# EAGLE schematic aircat (EAGLE 6.1)
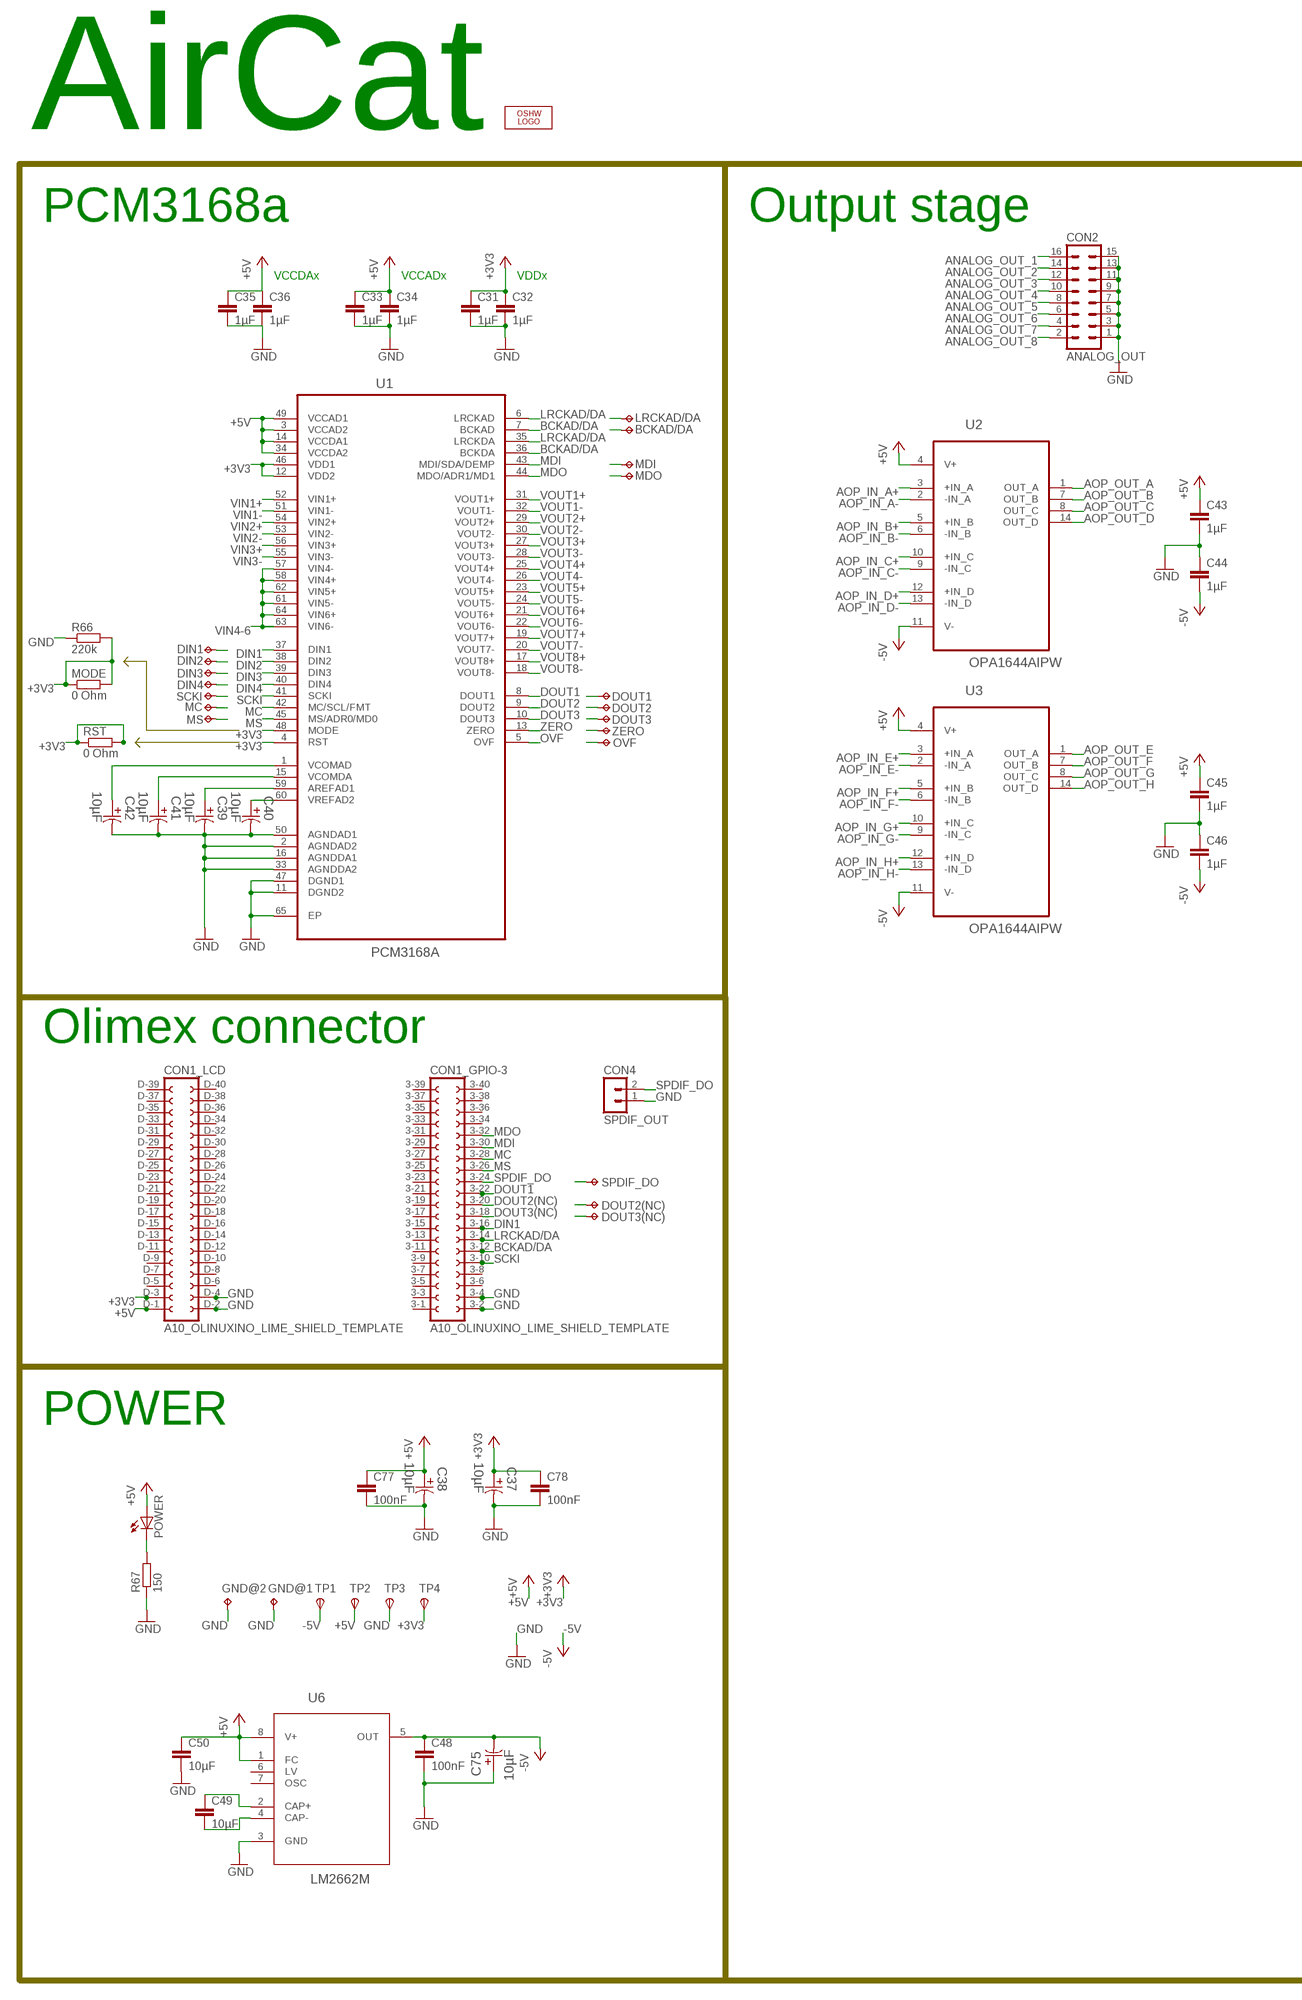
[diagram p0: schematic, sheet 1, part 1 of 2]
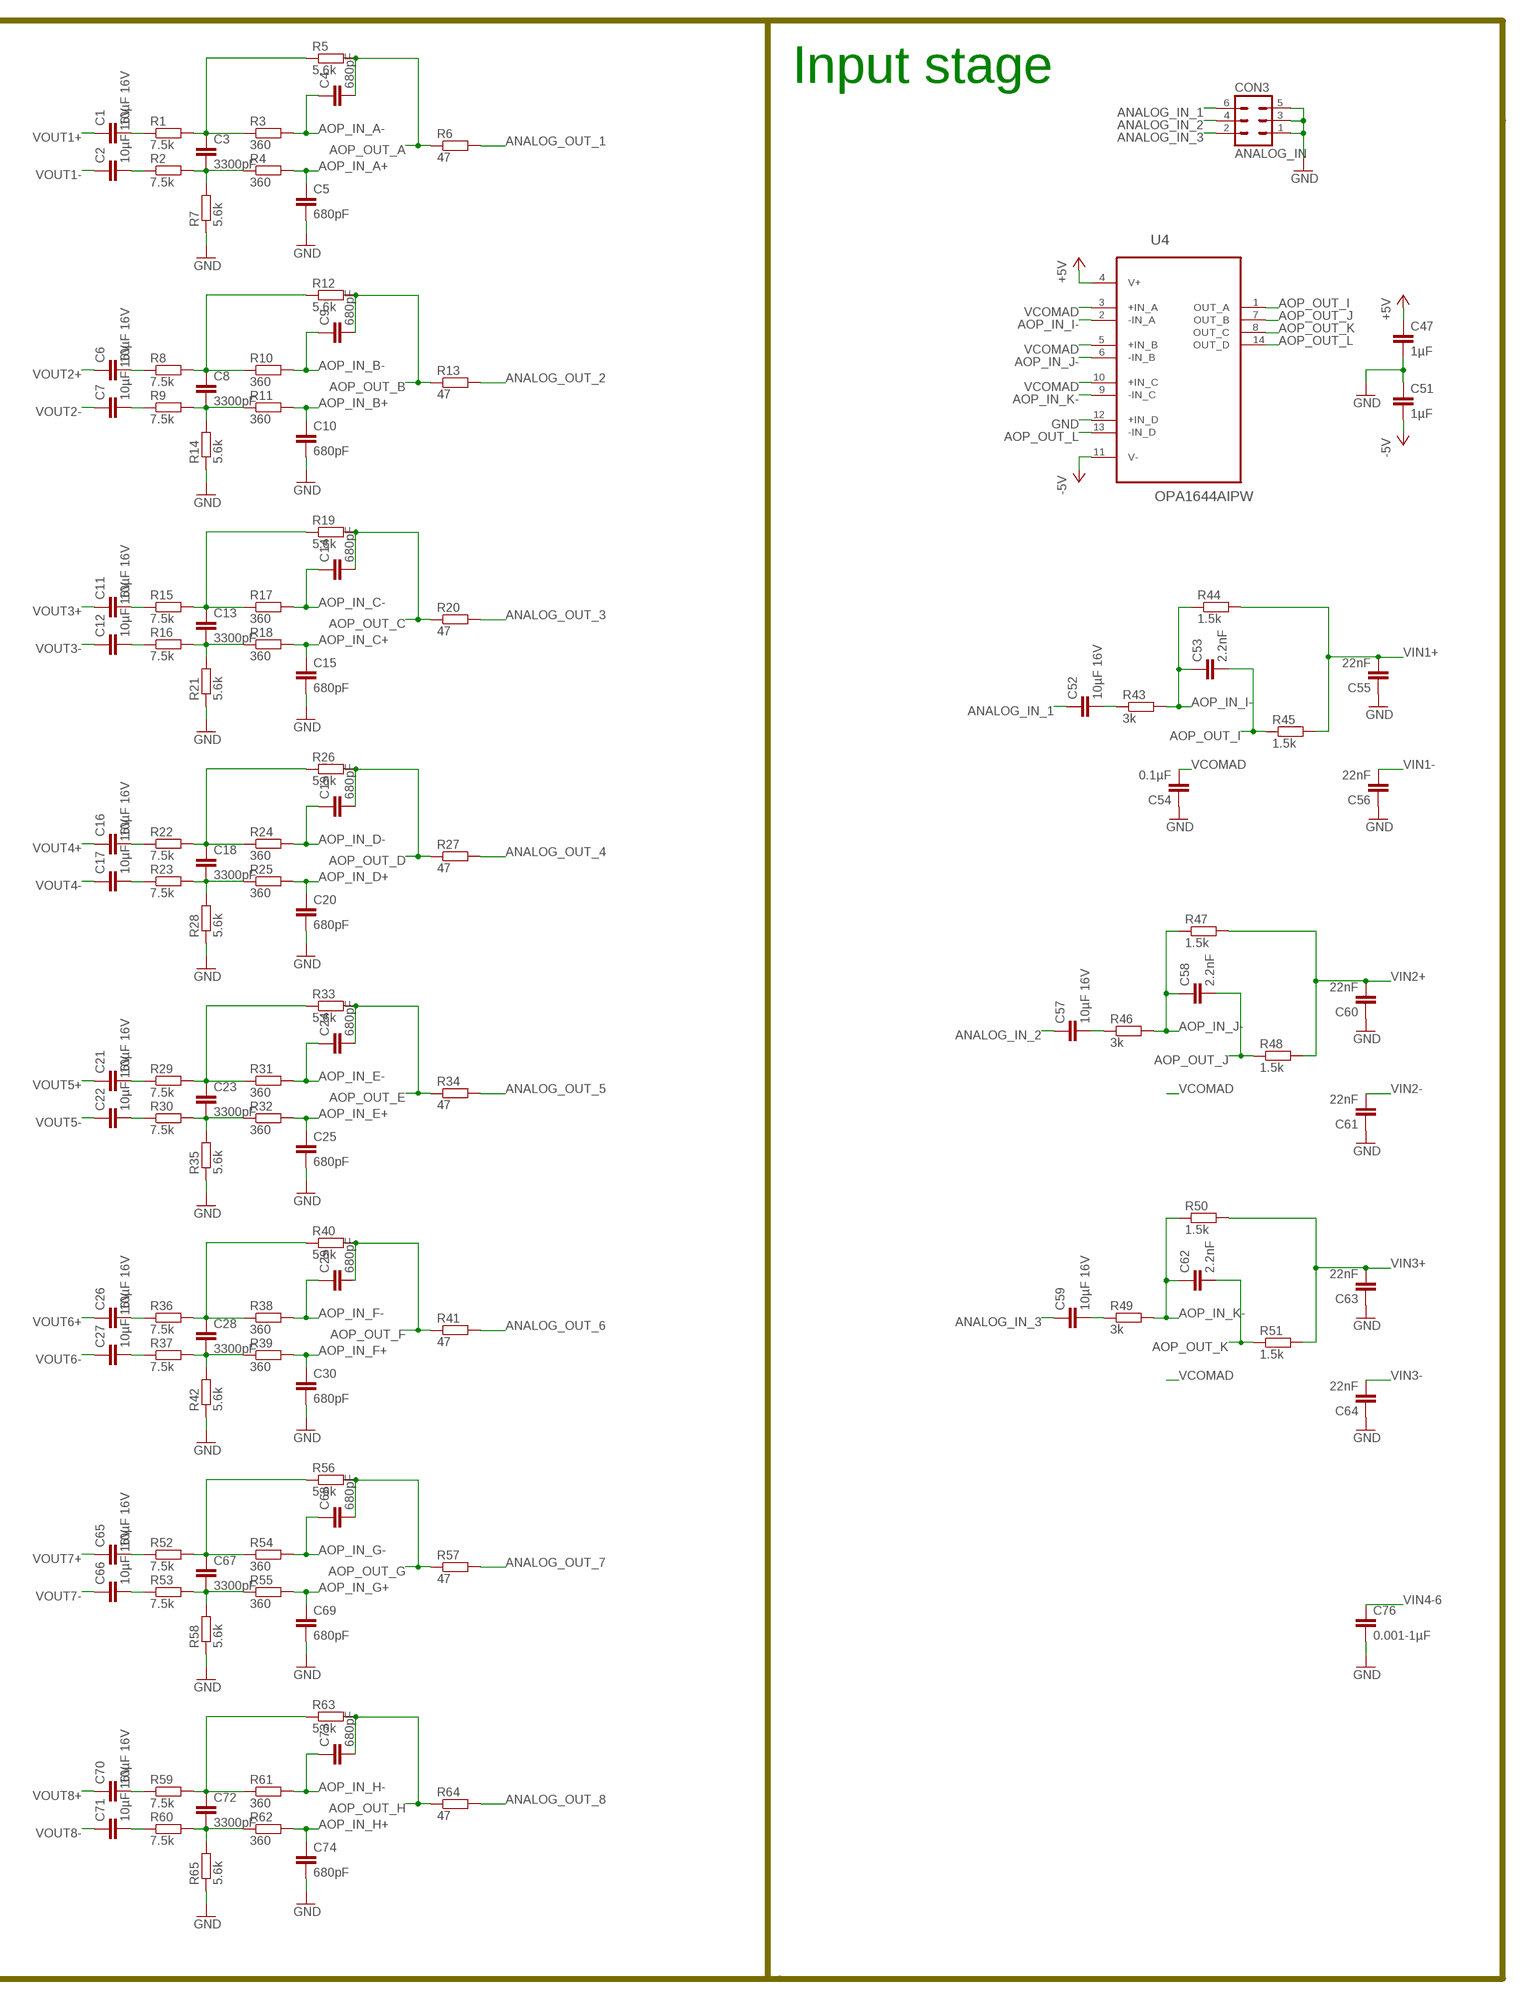
[diagram p1: schematic, sheet 1, part 2 of 2]

## Parts
BCKAD/DA  TPTP10SQ  [TP10SQ]
C1  10µF 16V  C-EUC0805  [C0805]
C2  10µF 16V  C-EUC0805  [C0805]
C3  3300pF  C-EUC0603  [C0603]
C4  680pF  C-EUC0603  [C0603]
C5  680pF  C-EUC0603  [C0603]
C6  10µF 16V  C-EUC0805  [C0805]
C7  10µF 16V  C-EUC0805  [C0805]
C8  3300pF  C-EUC0603  [C0603]
C9  680pF  C-EUC0603  [C0603]
C10  680pF  C-EUC0603  [C0603]
C11  10µF 16V  C-EUC0805  [C0805]
C12  10µF 16V  C-EUC0805  [C0805]
C13  3300pF  C-EUC0603  [C0603]
C14  680pF  C-EUC0603  [C0603]
C15  680pF  C-EUC0603  [C0603]
C16  10µF 16V  C-EUC0805  [C0805]
C17  10µF 16V  C-EUC0805  [C0805]
C18  3300pF  C-EUC0603  [C0603]
C19  680pF  C-EUC0603  [C0603]
C20  680pF  C-EUC0603  [C0603]
C21  10µF 16V  C-EUC0805  [C0805]
C22  10µF 16V  C-EUC0805  [C0805]
C23  3300pF  C-EUC0603  [C0603]
C24  680pF  C-EUC0603  [C0603]
C25  680pF  C-EUC0603  [C0603]
C26  10µF 16V  C-EUC0805  [C0805]
C27  10µF 16V  C-EUC0805  [C0805]
C28  3300pF  C-EUC0603  [C0603]
C29  680pF  C-EUC0603  [C0603]
C30  680pF  C-EUC0603  [C0603]
C31  1µF  C-EUC0603  [C0603]
C32  1µF  C-EUC0603  [C0603]
C33  1µF  C-EUC0603  [C0603]
C34  1µF  C-EUC0603  [C0603]
C35  1µF  C-EUC0603  [C0603]
C36  1µF  C-EUC0603  [C0603]
C37  10µF  EEE-FK1V100UR-CASE-B  [CAPAE430X610N]
C38  10µF  EEE-FK1V100UR-CASE-B  [CAPAE430X610N]
C39  10µF  EEE-FK1V100UR-CASE-B  [CAPAE430X610N]
C40  10µF  EEE-FK1V100UR-CASE-B  [CAPAE430X610N]
C41  10µF  EEE-FK1V100UR-CASE-B  [CAPAE430X610N]
C42  10µF  EEE-FK1V100UR-CASE-B  [CAPAE430X610N]
C43  1µF  C-EUC0603  [C0603]
C44  1µF  C-EUC0603  [C0603]
C45  1µF  C-EUC0603  [C0603]
C46  1µF  C-EUC0603  [C0603]
C47  1µF  C-EUC0603  [C0603]
C48  100nF  C-EUC0603  [C0603]
C49  10µF  C-EUC0805  [C0805]
C50  10µF  C-EUC0805  [C0805]
C51  1µF  C-EUC0603  [C0603]
C52  10µF 16V  C-EUC0805  [C0805]
C53  2.2nF  C-EUC0603  [C0603]
C54  0.1µF  C-EUC0603  [C0603]
C55  22nF  C-EUC0603  [C0603]
C56  22nF  C-EUC0603  [C0603]
C57  10µF 16V  C-EUC0805  [C0805]
C58  2.2nF  C-EUC0603  [C0603]
C59  10µF 16V  C-EUC0805  [C0805]
C60  22nF  C-EUC0603  [C0603]
C61  22nF  C-EUC0603  [C0603]
C62  2.2nF  C-EUC0603  [C0603]
C63  22nF  C-EUC0603  [C0603]
C64  22nF  C-EUC0603  [C0603]
C65  10µF 16V  C-EUC0805  [C0805]
C66  10µF 16V  C-EUC0805  [C0805]
C67  3300pF  C-EUC0603  [C0603]
C68  680pF  C-EUC0603  [C0603]
C69  680pF  C-EUC0603  [C0603]
C70  10µF 16V  C-EUC0805  [C0805]
C71  10µF 16V  C-EUC0805  [C0805]
C72  3300pF  C-EUC0603  [C0603]
C73  680pF  C-EUC0603  [C0603]
C74  680pF  C-EUC0603  [C0603]
C75  10µF  EEE-FK1V100UR-CASE-B  [CAPAE430X610N]
C76  0.001-1µF  C-EUC0603  [C0603]
C77  100nF  C-EUC0603  [C0603]
C78  100nF  C-EUC0603  [C0603]
CON1  A10_OLINUXINO_LIME_SHIELD_TEMPLATE  [A10_OLINUXINO_LIME_SHIELD]
CON2  ANALOG_OUT  MA08-2  [MA08-2]
CON3  ANALOG_IN  MA03-2  [MA03-2]
CON4  SPDIF_OUT  MA02-1  [MA02-1]
DIN1  TPTP10SQ  [TP10SQ]
DIN2  TPTP10SQ  [TP10SQ]
DIN3  TPTP10SQ  [TP10SQ]
DIN4  TPTP10SQ  [TP10SQ]
DOUT1  TPTP10SQ  [TP10SQ]
DOUT2  TPTP10SQ  [TP10SQ]
DOUT2(NC)  TPTP10SQ  [TP10SQ]
DOUT3  TPTP10SQ  [TP10SQ]
DOUT3(NC)  TPTP10SQ  [TP10SQ]
GND@1  TPTP10SQ  [TP10SQ]
GND@2  TPTP10SQ  [TP10SQ]
LOGO1  OSHW_LOGO_FILLX0200-NT  [OSHW_FILLX200_NOTEXT]
LRCKAD/DA  TPTP10SQ  [TP10SQ]
MC  TPTP10SQ  [TP10SQ]
MDI  TPTP10SQ  [TP10SQ]
MDO  TPTP10SQ  [TP10SQ]
MODE  0 Ohm  R-EU_R0603  [R0603]
MS  TPTP10SQ  [TP10SQ]
OVF  TPTP10SQ  [TP10SQ]
POWER  LEDSML0603  [SML0603]
R1  7.5k  R-EU_R0603  [R0603]
R2  7.5k  R-EU_R0603  [R0603]
R3  360  R-EU_R0603  [R0603]
R4  360  R-EU_R0603  [R0603]
R5  5.6k  R-EU_R0603  [R0603]
R6  47  R-EU_R0603  [R0603]
R7  5.6k  R-EU_R0603  [R0603]
R8  7.5k  R-EU_R0603  [R0603]
R9  7.5k  R-EU_R0603  [R0603]
R10  360  R-EU_R0603  [R0603]
R11  360  R-EU_R0603  [R0603]
R12  5.6k  R-EU_R0603  [R0603]
R13  47  R-EU_R0603  [R0603]
R14  5.6k  R-EU_R0603  [R0603]
R15  7.5k  R-EU_R0603  [R0603]
R16  7.5k  R-EU_R0603  [R0603]
R17  360  R-EU_R0603  [R0603]
R18  360  R-EU_R0603  [R0603]
R19  5.6k  R-EU_R0603  [R0603]
R20  47  R-EU_R0603  [R0603]
R21  5.6k  R-EU_R0603  [R0603]
R22  7.5k  R-EU_R0603  [R0603]
R23  7.5k  R-EU_R0603  [R0603]
R24  360  R-EU_R0603  [R0603]
R25  360  R-EU_R0603  [R0603]
R26  5.6k  R-EU_R0603  [R0603]
R27  47  R-EU_R0603  [R0603]
R28  5.6k  R-EU_R0603  [R0603]
R29  7.5k  R-EU_R0603  [R0603]
R30  7.5k  R-EU_R0603  [R0603]
R31  360  R-EU_R0603  [R0603]
R32  360  R-EU_R0603  [R0603]
R33  5.6k  R-EU_R0603  [R0603]
R34  47  R-EU_R0603  [R0603]
R35  5.6k  R-EU_R0603  [R0603]
R36  7.5k  R-EU_R0603  [R0603]
R37  7.5k  R-EU_R0603  [R0603]
R38  360  R-EU_R0603  [R0603]
R39  360  R-EU_R0603  [R0603]
R40  5.6k  R-EU_R0603  [R0603]
R41  47  R-EU_R0603  [R0603]
R42  5.6k  R-EU_R0603  [R0603]
R43  3k  R-EU_R0603  [R0603]
R44  1.5k  R-EU_R0603  [R0603]
R45  1.5k  R-EU_R0603  [R0603]
R46  3k  R-EU_R0603  [R0603]
R47  1.5k  R-EU_R0603  [R0603]
R48  1.5k  R-EU_R0603  [R0603]
R49  3k  R-EU_R0603  [R0603]
R50  1.5k  R-EU_R0603  [R0603]
R51  1.5k  R-EU_R0603  [R0603]
R52  7.5k  R-EU_R0603  [R0603]
R53  7.5k  R-EU_R0603  [R0603]
R54  360  R-EU_R0603  [R0603]
R55  360  R-EU_R0603  [R0603]
R56  5.6k  R-EU_R0603  [R0603]
R57  47  R-EU_R0603  [R0603]
R58  5.6k  R-EU_R0603  [R0603]
R59  7.5k  R-EU_R0603  [R0603]
R60  7.5k  R-EU_R0603  [R0603]
R61  360  R-EU_R0603  [R0603]
R62  360  R-EU_R0603  [R0603]
R63  5.6k  R-EU_R0603  [R0603]
R64  47  R-EU_R0603  [R0603]
R65  5.6k  R-EU_R0603  [R0603]
R66  220k  R-EU_R0603  [R0603]
R67  150  R-EU_R0603  [R0603]
RST  0 Ohm  R-EU_R0603  [R0603]
SCKI  TPTP10SQ  [TP10SQ]
SPDIF_DO  TPTP10SQ  [TP10SQ]
TP1  -5V  TPSB1,27  [B1,27]
TP2  +5V  TPSB1,27  [B1,27]
TP3  GND  TPSB1,27  [B1,27]
TP4  +3V3  TPSB1,27  [B1,27]
U1  PCM3168A  PCM3168APAP  [QFP50P1200X1200X120-65N]
U2  OPA1644AIPW  [SOP65P640X120-14N]
U3  OPA1644AIPW  [SOP65P640X120-14N]
U4  OPA1644AIPW  [SOP65P640X120-14N]
U6  LM2662M  [SOIC127P620X175-8N]
ZERO  TPTP10SQ  [TP10SQ]

## Nets
+3V3: C31.1 C32.1 C37.1 C78.1 CON1.D-3 MODE.1 MODE.2 R66.2 RST.1 RST.2 TP4.TP(PP) U1.4(RST) U1.12(VDD2) U1.46(VDD1) U1.48(MODE)
+5V: C33.1 C34.1 C35.1 C36.1 C38.1 C43.1 C45.1 C47.1 C50.1 C77.1 CON1.D-1 POWER.A TP2.TP(PP) U1.3(VCCAD2) U1.14(VCCDA1) U1.34(VCCDA2) U1.49(VCCAD1) U2.4(V+) U3.4(V+) U4.4(V+) U6.1(FC) U6.8(V+)
-5V: C44.2 C46.2 C48.1 C51.2 C75.2 TP1.TP(PP) U2.11(V-) U3.11(V-) U4.11(V-) U6.5(OUT)
ANALOG_IN_1: C52.1 CON3.6
ANALOG_IN_2: C57.1 CON3.4
ANALOG_IN_3: C59.1 CON3.2
ANALOG_OUT_1: CON2.16 R6.2
ANALOG_OUT_2: CON2.14 R13.2
ANALOG_OUT_3: CON2.12 R20.2
ANALOG_OUT_4: CON2.10 R27.2
ANALOG_OUT_5: CON2.8 R34.2
ANALOG_OUT_6: CON2.6 R41.2
ANALOG_OUT_7: CON2.4 R57.2
ANALOG_OUT_8: CON2.2 R64.2
AOP_IN_A+: C5.1 R4.2 U2.3(+IN_A)
AOP_IN_A-: C4.1 R3.2 U2.2(-IN_A)
AOP_IN_B+: C10.1 R11.2 U2.5(+IN_B)
AOP_IN_B-: C9.1 R10.2 U2.6(-IN_B)
AOP_IN_C+: C15.1 R18.2 U2.10(+IN_C)
AOP_IN_C-: C14.1 R17.2 U2.9(-IN_C)
AOP_IN_D+: C20.1 R25.2 U2.12(+IN_D)
AOP_IN_D-: C19.1 R24.2 U2.13(-IN_D)
AOP_IN_E+: C25.1 R32.2 U3.3(+IN_A)
AOP_IN_E-: C24.1 R31.2 U3.2(-IN_A)
AOP_IN_F+: C30.1 R39.2 U3.5(+IN_B)
AOP_IN_F-: C29.1 R38.2 U3.6(-IN_B)
AOP_IN_G+: C69.1 R55.2 U3.10(+IN_C)
AOP_IN_G-: C68.1 R54.2 U3.9(-IN_C)
AOP_IN_H+: C74.1 R62.2 U3.12(+IN_D)
AOP_IN_H-: C73.1 R61.2 U3.13(-IN_D)
AOP_IN_I-: C53.1 R43.2 R44.1 U4.2(-IN_A)
AOP_IN_J-: C58.1 R46.2 R47.1 U4.6(-IN_B)
AOP_IN_K-: C62.1 R49.2 R50.1 U4.9(-IN_C)
AOP_OUT_A: C4.2 R5.2 R6.1 U2.1(OUT_A)
AOP_OUT_B: C9.2 R12.2 R13.1 U2.7(OUT_B)
AOP_OUT_C: C14.2 R19.2 R20.1 U2.8(OUT_C)
AOP_OUT_D: C19.2 R26.2 R27.1 U2.14(OUT_D)
AOP_OUT_E: C24.2 R33.2 R34.1 U3.1(OUT_A)
AOP_OUT_F: C29.2 R40.2 R41.1 U3.7(OUT_B)
AOP_OUT_G: C68.2 R56.2 R57.1 U3.8(OUT_C)
AOP_OUT_H: C73.2 R63.2 R64.1 U3.14(OUT_D)
AOP_OUT_I: C53.2 R45.1 U4.1(OUT_A)
AOP_OUT_J: C58.2 R48.1 U4.7(OUT_B)
AOP_OUT_K: C62.2 R51.1 U4.8(OUT_C)
AOP_OUT_L: U4.13(-IN_D) U4.14(OUT_D)
AREFAD1: C39.1 U1.59(AREFAD1)
BCKAD/DA: BCKAD/DA.TP CON1.3-12 U1.7(BCKAD) U1.36(BCKDA)
DIN1: CON1.3-16 DIN1.TP U1.37(DIN1)
DIN2: DIN2.TP U1.38(DIN2)
DIN3: DIN3.TP U1.39(DIN3)
DIN4: DIN4.TP U1.40(DIN4)
DOUT1: CON1.3-22 DOUT1.TP U1.8(DOUT1)
DOUT2: DOUT2.TP U1.9(DOUT2)
DOUT2(NC): CON1.3-20 DOUT2(NC).TP
DOUT3: DOUT3.TP U1.10(DOUT3)
DOUT3(NC): CON1.3-18 DOUT3(NC).TP
GND: C5.2 C10.2 C15.2 C20.2 C25.2 C30.2 C31.2 C32.2 C33.2 C34.2 C35.2 C36.2 C37.2 C38.2 C39.2 C40.2 C41.2 C42.2 C43.2 C44.1 C45.2 C46.1 C47.2 C48.2 C50.2 C51.1 C54.1 C55.1 C56.1 C60.1 C61.1 C63.1 C64.1 C69.2 C74.2 C75.1 C76.2 C77.2 C78.2 CON1.3-2 CON1.3-4 CON1.D-2 CON1.D-4 CON2.1 CON2.3 CON2.5 CON2.7 CON2.9 CON2.11 CON2.13 CON2.15 CON3.1 CON3.3 CON3.5 CON4.1 GND@1.TP GND@2.TP R7.1 R14.1 R21.1 R28.1 R35.1 R42.1 R58.1 R65.1 R66.1 R67.1 TP3.TP(PP) U1.2(AGNDAD2) U1.11(DGND2) U1.16(AGNDDA1) U1.33(AGNDDA2) U1.47(DGND1) U1.50(AGNDAD1) U1.65(EP) U4.12(+IN_D) U6.3(GND)
LRCKAD/DA: CON1.3-14 LRCKAD/DA.TP U1.6(LRCKAD) U1.35(LRCKDA)
MC: CON1.3-28 MC.TP U1.42(MC/SCL/FMT)
MDI: CON1.3-30 MDI.TP U1.43(MDI/SDA/DEMP)
MDO: CON1.3-32 MDO.TP U1.44(MDO/ADR1/MD1)
MS: CON1.3-26 MS.TP U1.45(MS/ADR0/MD0)
N$1: C2.2 R2.1
N$2: C1.2 R1.1
N$3: C3.1 R1.2 R3.1 R5.1
N$4: C3.2 R2.2 R4.1 R7.2
N$5: C7.2 R9.1
N$6: C6.2 R8.1
N$7: C8.1 R8.2 R10.1 R12.1
N$8: C8.2 R9.2 R11.1 R14.2
N$9: C12.2 R16.1
N$10: C11.2 R15.1
N$11: C13.1 R15.2 R17.1 R19.1
N$12: C13.2 R16.2 R18.1 R21.2
N$13: C17.2 R23.1
N$14: C16.2 R22.1
N$15: C18.1 R22.2 R24.1 R26.1
N$16: C18.2 R23.2 R25.1 R28.2
N$17: C22.2 R30.1
N$18: C21.2 R29.1
N$19: C23.1 R29.2 R31.1 R33.1
N$20: C23.2 R30.2 R32.1 R35.2
N$21: C27.2 R37.1
N$22: C26.2 R36.1
N$23: C28.1 R36.2 R38.1 R40.1
N$24: C28.2 R37.2 R39.1 R42.2
N$25: C52.2 R43.1
N$26: C57.2 R46.1
N$27: C59.2 R49.1
N$28: C66.2 R53.1
N$29: C65.2 R52.1
N$30: C67.1 R52.2 R54.1 R56.1
N$31: C67.2 R53.2 R55.1 R58.2
N$32: C71.2 R60.1
N$33: C70.2 R59.1
N$34: C49.1 U6.2(CAP+)
N$35: C49.2 U6.4(CAP-)
N$36: C72.1 R59.2 R61.1 R63.1
N$37: C72.2 R60.2 R62.1 R65.2
N$38: POWER.C R67.2
OVF: OVF.TP U1.5(OVF)
SCKI: CON1.3-10 SCKI.TP U1.41(SCKI)
SPDIF_DO: CON1.3-24 CON4.2 SPDIF_DO.TP
VCOMAD: C42.1 C54.2 U1.1(VCOMAD) U4.3(+IN_A) U4.5(+IN_B) U4.10(+IN_C)
VCOMDA: C41.1 U1.15(VCOMDA)
VIN1+: C55.2 R44.2 R45.2 U1.52(VIN1+)
VIN1-: C56.2 U1.51(VIN1-)
VIN2+: C60.2 R47.2 R48.2 U1.54(VIN2+)
VIN2-: C61.2 U1.53(VIN2-)
VIN3+: C63.2 R50.2 R51.2 U1.56(VIN3+)
VIN3-: C64.2 U1.55(VIN3-)
VIN4-6: C76.1 U1.57(VIN4-) U1.58(VIN4+) U1.61(VIN5-) U1.62(VIN5+) U1.63(VIN6-) U1.64(VIN6+)
VOUT1+: C1.1 U1.31(VOUT1+)
VOUT1-: C2.1 U1.32(VOUT1-)
VOUT2+: C6.1 U1.29(VOUT2+)
VOUT2-: C7.1 U1.30(VOUT2-)
VOUT3+: C11.1 U1.27(VOUT3+)
VOUT3-: C12.1 U1.28(VOUT3-)
VOUT4+: C16.1 U1.25(VOUT4+)
VOUT4-: C17.1 U1.26(VOUT4-)
VOUT5+: C21.1 U1.23(VOUT5+)
VOUT5-: C22.1 U1.24(VOUT5-)
VOUT6+: C26.1 U1.21(VOUT6+)
VOUT6-: C27.1 U1.22(VOUT6-)
VOUT7+: C65.1 U1.19(VOUT7+)
VOUT7-: C66.1 U1.20(VOUT7-)
VOUT8+: C70.1 U1.17(VOUT8+)
VOUT8-: C71.1 U1.18(VOUT8-)
VREFAD2: C40.1 U1.60(VREFAD2)
ZERO: U1.13(ZERO) ZERO.TP
Unconnected: CON1.3-1 CON1.3-3 CON1.3-5 CON1.3-6 CON1.3-7 CON1.3-8 CON1.3-9 CON1.3-11 CON1.3-13 CON1.3-15 CON1.3-17 CON1.3-19 CON1.3-21 CON1.3-23 CON1.3-25 CON1.3-27 CON1.3-29 CON1.3-31 CON1.3-33 CON1.3-34 CON1.3-35 CON1.3-36 CON1.3-37 CON1.3-38 CON1.3-39 CON1.3-40 CON1.D-5 CON1.D-6 CON1.D-7 CON1.D-8 CON1.D-9 CON1.D-10 CON1.D-11 CON1.D-12 CON1.D-13 CON1.D-14 CON1.D-15 CON1.D-16 CON1.D-17 CON1.D-18 CON1.D-19 CON1.D-20 CON1.D-21 CON1.D-22 CON1.D-23 CON1.D-24 CON1.D-25 CON1.D-26 CON1.D-27 CON1.D-28 CON1.D-29 CON1.D-30 CON1.D-31 CON1.D-32 CON1.D-33 CON1.D-34 CON1.D-35 CON1.D-36 CON1.D-37 CON1.D-38 CON1.D-39 CON1.D-40 U6.6(LV) U6.7(OSC)

## Notes on the sheet
- AirCat
- PCM3168a | Output stage | Input stage
- VCCDAx | VCCADx | VDDx
- Olimex connector
- POWER

## Library data of the parts
BCKAD/DA DIN1-DIN4 DOUT1 DOUT2 DOUT2(NC) DOUT3 DOUT3(NC) GND@1 GND@2 LRCKAD/DA MC MDI MDO MS OVF SCKI SPDIF_DO ZERO = testpad:TP: Test pad; OC_FARNELL: unknown
C1 C2 C6 C7 C11 C12 C16 C17 C21 C22 C26 C27 C52 C57 C59 C65 C66 C70 C71 = rcl:C-EU: CAPACITOR, European symbol; MF: AVX; MPN: 1206YD106KAT2A; OC_FARNELL: 1327727
C3 C8 C13 C18 C23 C28 C67 C72 = rcl:C-EU: CAPACITOR, European symbol; MF: AVX; MPN: 06035C332KAT2A; OC_FARNELL: 317251
C4 C5 C9 C10 C14 C15 C19 C20 C24 C25 C29 C30 C68 C69 C73 C74 = rcl:C-EU: CAPACITOR, European symbol; MF: KEMET; MPN: C0603C681J5GACTU; OC_FARNELL: 1414648
C31-C36 C43-C47 C51 = rcl:C-EU: CAPACITOR, European symbol; MF: AVX; MPN: 0603ZD105KAT2A; OC_FARNELL: 1327684
C37-C42 C75 = Panasonic-EEEFK_EEEFP:EEE-: Aluminum Electrolytic Capacitors,Surface Mount Type; MF: PANASONIC; MPN: EEEFK1V100UR; OC_FARNELL: 9695826; OC_NEWARK: 96K9406; PACKAGE: CASE-B; SUPPLIER: PANASONIC; TOLERANCE: ±20 %; VALUE: 10UF; VOLTAGERATING: 35V
C48-C50 = rcl:C-EU: CAPACITOR, European symbol; MF: SANYO; MPN: 10SVP10M; OC_FARNELL: 9188878
C53 C58 C62 = rcl:C-EU: CAPACITOR, European symbol; MF: AVX; MPN: 06035C222KAT2A; OC_FARNELL: 498592
C54 = rcl:C-EU: CAPACITOR, European symbol; MF: AVX; MPN: 0402YD104KAT2A; OC_FARNELL: 1327666
C55 C56 C60 C61 C63 C64 = rcl:C-EU: CAPACITOR, European symbol; MF: AVX; MPN: 06033C223KAT2A; OC_FARNELL: 578174
C76 = rcl:C-EU: CAPACITOR, European symbol; OC_FARNELL: unknown
C77 C78 = rcl:C-EU: CAPACITOR, European symbol; MF: AVX; MPN: 06033D104KAT2A; OC_FARNELL: 2332591
CON1 = A10_OLIMEXINO_LIME_SHIELD_edit:A10_OLINUXINO_LIME_SHIELD_TEMPLATE; OC_FARNELL: unknown
CON2 = con-lstb-without-pin-numbers:MA08-2: PIN HEADER; OC_FARNELL: unknown; OC_NEWARK: unknown
CON3 = con-lstb-without-pin-numbers:MA03-2: PIN HEADER; OC_FARNELL: unknown; OC_NEWARK: unknown
CON4 = con-lstb-without-pin-numbers:MA02-1
LOGO1 = ohw-logo:OSHW_LOGO_FILL
MODE R3 R4 R6 R10 R11 R13 R17 R18 R20 R24 R25 R27 R31 R32 R34 R38 R39 R41 R44 R45 R47 R48 R50 R51 R54 R55 R57 R61 R62 R64 R66 RST = rcl:R-EU_: RESISTOR, European symbol; OC_FARNELL: unknown
POWER = led:LED: LED OSRAM: - CHIPLED LG R971, LG N971, LY N971, LG Q971, LY Q971, LO R971, LY R971 LH N974, LH R974 LS Q976, LO Q976, LY Q976 LO Q996 - Hyper CHIPLED LW Q18S LB Q993, LB Q99A, LB R99A - SideLED LS A670, LO A670, LY A670, LG A670, LP A670 LB A673, LV A673, LT A673, LW A673 LH A674 LY A675 LS A676, LA A676, LO A676, LY A676, LW A676 LS A679, LY A679, LG A679 - Hyper Micro SIDELED® LS Y876, LA Y876, LO Y876, LY Y876 LT Y87S - SmartLED LW L88C, LW L88S LB L89C, LB L89S, LG L890 LS L89K, LO L89K, LY L89K LS L896, LA L896, LO L896, LY L896 - TOPLED LS T670, LO T670, LY T670, LG T670, LP T670 LSG T670, LSP T670, LSY T670, LOP T670, LYG T670 LG T671, LOG T671, LSG T671 LB T673, LV T673, LT T673, LW T673 LH T674 LS T676, LA T676, LO T676, LY T676, LB T676, LH T676, LSB T676, LW T676 LB T67C, LV T67C, LT T67C, LS T67K, LO T67K, LY T67K, LW E67C LS E67B, LA E67B, LO E67B, LY E67B, LB E67C, LV E67C, LT E67C LW T67C LS T679, LY T679, LG T679 LS T770, LO T770, LY T770, LG T770, LP T770 LB T773, LV T773, LT T773, LW T773 LH T774 LS E675, LA E675, LY E675, LS T675 LS T776, LA T776, LO T776, LY T776, LB T776 LHGB T686 LT T68C, LB T68C - Hyper Mini TOPLED® LB M676 - Mini TOPLED Santana® LG M470 LS M47K, LO M47K, LY M47K Source: http://www.osram.convergy.de LUXEON: - LUMILED® LXK2-PW12-R00, LXK2-PW12-S00, LXK2-PW14-U00, LXK2-PW14-V00 LXK2-PM12-R00, LXK2-PM12-S00, LXK2-PM14-U00 LXK2-PE12-Q00, LXK2-PE12-R00, LXK2-PE12-S00, LXK2-PE14-T00, LXK2-PE14-U00 LXK2-PB12-K00, LXK2-PB12-L00, LXK2-PB12-M00, LXK2-PB14-N00, LXK2-PB14-P00, LXK2-PB14-Q00 LXK2-PR12-L00, LXK2-PR12-M00, LXK2-PR14-Q00, LXK2-PR14-R00 LXK2-PD12-Q00, LXK2-PD12-R00, LXK2-PD12-S00 LXK2-PH12-R00, LXK2-PH12-S00 LXK2-PL12-P00, LXK2-PL12-Q00, LXK2-PL12-R00 Source: www.luxeon.com KINGBRIGHT: KA-3528ASYC Source: www.kingbright.com
R1 R2 R8 R9 R15 R16 R22 R23 R29 R30 R36 R37 R52 R53 R59 R60 R67 = rcl:R-EU_: RESISTOR, European symbol; MF: MULTICOMP; MPN: MCRE000161; OC_FARNELL: 1711638
R5 R7 R12 R14 R19 R21 R26 R28 R33 R35 R40 R42 R56 R58 R63 R65 = rcl:R-EU_: RESISTOR, European symbol; MF: MULTICOMP; MPN: MCPWR05FTEW5601; OC_FARNELL: 1887301
R43 R46 R49 = rcl:R-EU_: RESISTOR, European symbol; MF: WERA; MPN: 167I 3K TX 9 X 80 MM; OC_FARNELL: 2213661
TP1-TP4 = testpad:TPS: TEST PIN; OC_FARNELL: unknown
U1 = pcm3168:PCM3168APAP: 6-In/8-Out Audio Codec; MF: TEXAS INSTRUMENTS; MPN: PCM3168APAP; OC_FARNELL: 1689419; OC_NEWARK: 33P9825; PACKAGE: HTQFP-64; SUPPLIER: Texas Instruments
U2-U4 = OPA1644:OPA1644AIPW: AUDIO OPERATIONAL AMPLIFIERS; MF: TEXAS INSTRUMENTS; MPN: OPA1644AIPW; OC_FARNELL: 1882283; OC_NEWARK: 27T6636; PACKAGE: TSSOP-14; SUPPLIER: Texas Instruments
U6 = TI-LM2662M:LM2662M: Switched Capacitor Voltage Converter; MF: TEXAS INSTRUMENTS; MPN: LM2662M; OC_FARNELL: 9306803; OC_NEWARK: 07B6186; PACKAGE: 8-SOIC; SUPPLIER: National Semiconductors

## Net classes
0 default: width 0.203 mm, drill 0.33 mm